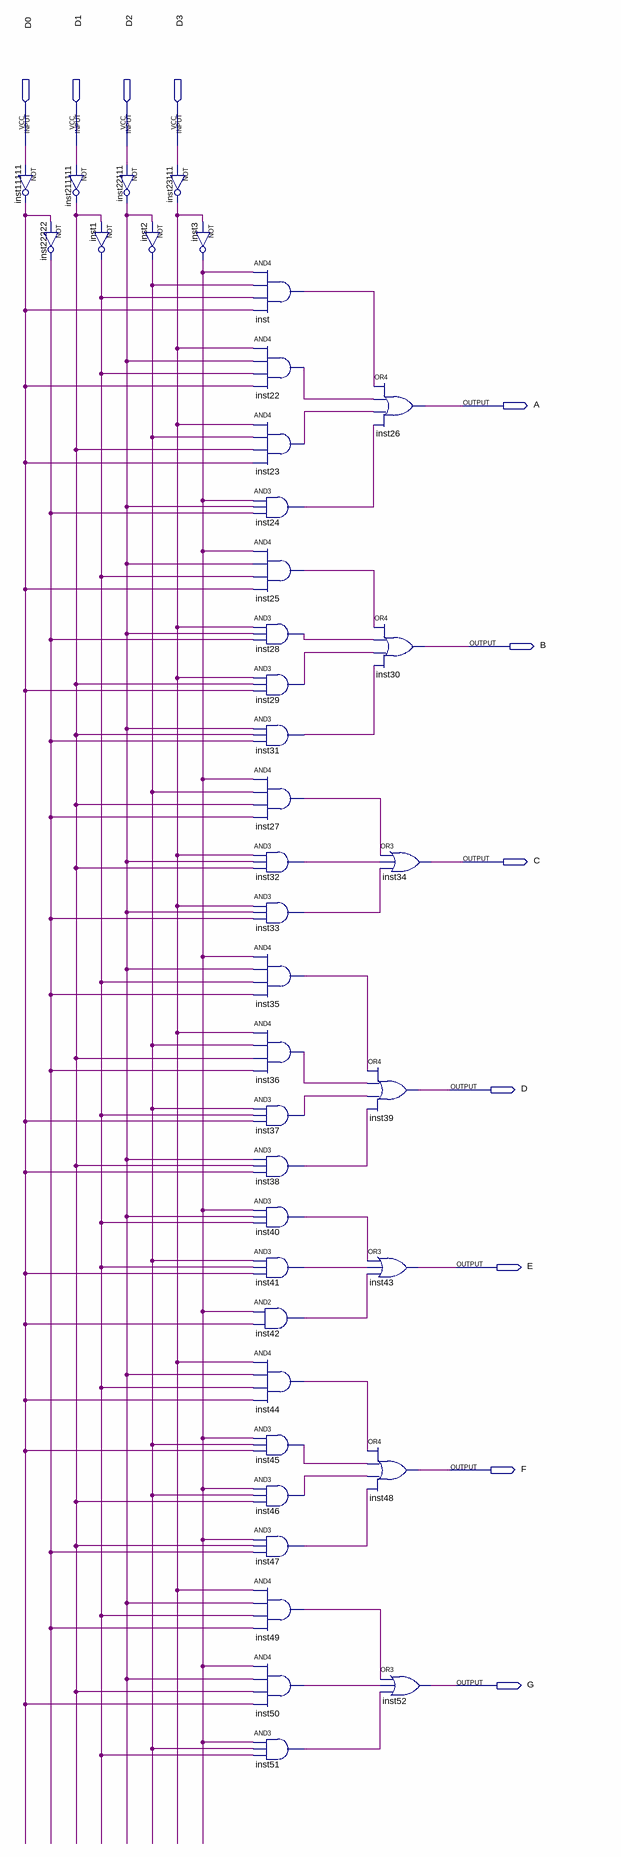
[diagram p0: schematic sheet]
// Quartus schematic seven.bdf as structural Verilog: 40 symbols, 11 pins
module seven (
  input  D0,
  input  D1,
  input  D2,
  input  D3,
  output A,
  output B,
  output C,
  output D,
  output E,
  output F,
  output G
);

  wire inst1_out, inst2_out, inst3_out, inst22_out, inst23_out, inst24_out, inst25_out, inst27_out,
       inst28_out, inst29_out, inst31_out, inst32_out, inst33_out, inst35_out, inst36_out, inst37_out,
       inst38_out, inst40_out, inst41_out, inst42_out, inst44_out, inst45_out, inst46_out, inst47_out,
       inst49_out, inst50_out, inst51_out, inst11111_out, inst22111_out, inst22222_out, inst23111_out,
       inst211111_out, inst_out;

  not inst11111 (inst11111_out, D0);
  not inst22222 (inst22222_out, inst11111_out);
  not inst211111 (inst211111_out, D1);
  not inst1 (inst1_out, inst211111_out);
  not inst22111 (inst22111_out, D2);
  not inst2 (inst2_out, inst22111_out);
  not inst23111 (inst23111_out, D3);
  not inst3 (inst3_out, inst23111_out);
  and inst (inst_out, inst3_out, inst2_out, inst1_out, inst11111_out);
  and inst22 (inst22_out, inst23111_out, inst22111_out, inst1_out, inst11111_out);
  and inst23 (inst23_out, inst23111_out, inst2_out, inst211111_out, inst11111_out);
  and inst24 (inst24_out, inst3_out, inst22111_out, inst22222_out);
  and inst25 (inst25_out, inst3_out, inst22111_out, inst1_out, inst11111_out);
  and inst28 (inst28_out, inst23111_out, inst22111_out, inst22222_out);
  and inst29 (inst29_out, inst23111_out, inst211111_out, inst11111_out);
  and inst31 (inst31_out, inst22111_out, inst211111_out, inst22222_out);
  and inst27 (inst27_out, inst3_out, inst2_out, inst211111_out, inst22222_out);
  and inst32 (inst32_out, inst23111_out, inst22111_out, inst211111_out);
  and inst33 (inst33_out, inst23111_out, inst22111_out, inst22222_out);
  and inst35 (inst35_out, inst3_out, inst22111_out, inst1_out, inst22222_out);
  and inst36 (inst36_out, inst23111_out, inst2_out, inst211111_out, inst22222_out);
  and inst37 (inst37_out, inst2_out, inst1_out, inst11111_out);
  and inst38 (inst38_out, inst22111_out, inst211111_out, inst11111_out);
  and inst40 (inst40_out, inst3_out, inst22111_out, inst1_out);
  and inst41 (inst41_out, inst2_out, inst1_out, inst11111_out);
  and inst42 (inst42_out, inst3_out, inst11111_out);
  and inst44 (inst44_out, inst23111_out, inst22111_out, inst1_out, inst11111_out);
  and inst45 (inst45_out, inst3_out, inst2_out, inst11111_out);
  and inst46 (inst46_out, inst3_out, inst2_out, inst211111_out);
  and inst47 (inst47_out, inst3_out, inst211111_out, inst22222_out);
  and inst49 (inst49_out, inst23111_out, inst22111_out, inst1_out, inst22222_out);
  and inst50 (inst50_out, inst3_out, inst22111_out, inst211111_out, inst11111_out);
  and inst51 (inst51_out, inst3_out, inst2_out, inst1_out);
  or inst26 (A, inst_out, inst22_out, inst23_out, inst24_out);
  or inst30 (B, inst25_out, inst28_out, inst29_out, inst31_out);
  or inst34 (C, inst27_out, inst32_out, inst33_out);
  or inst39 (D, inst35_out, inst36_out, inst37_out, inst38_out);
  or inst43 (E, inst40_out, inst41_out, inst42_out);
  or inst48 (F, inst44_out, inst45_out, inst46_out, inst47_out);
  or inst52 (G, inst49_out, inst50_out, inst51_out);
endmodule
